# EAGLE design MKRRelayShield_V4.0 (EAGLE 9.1.3)
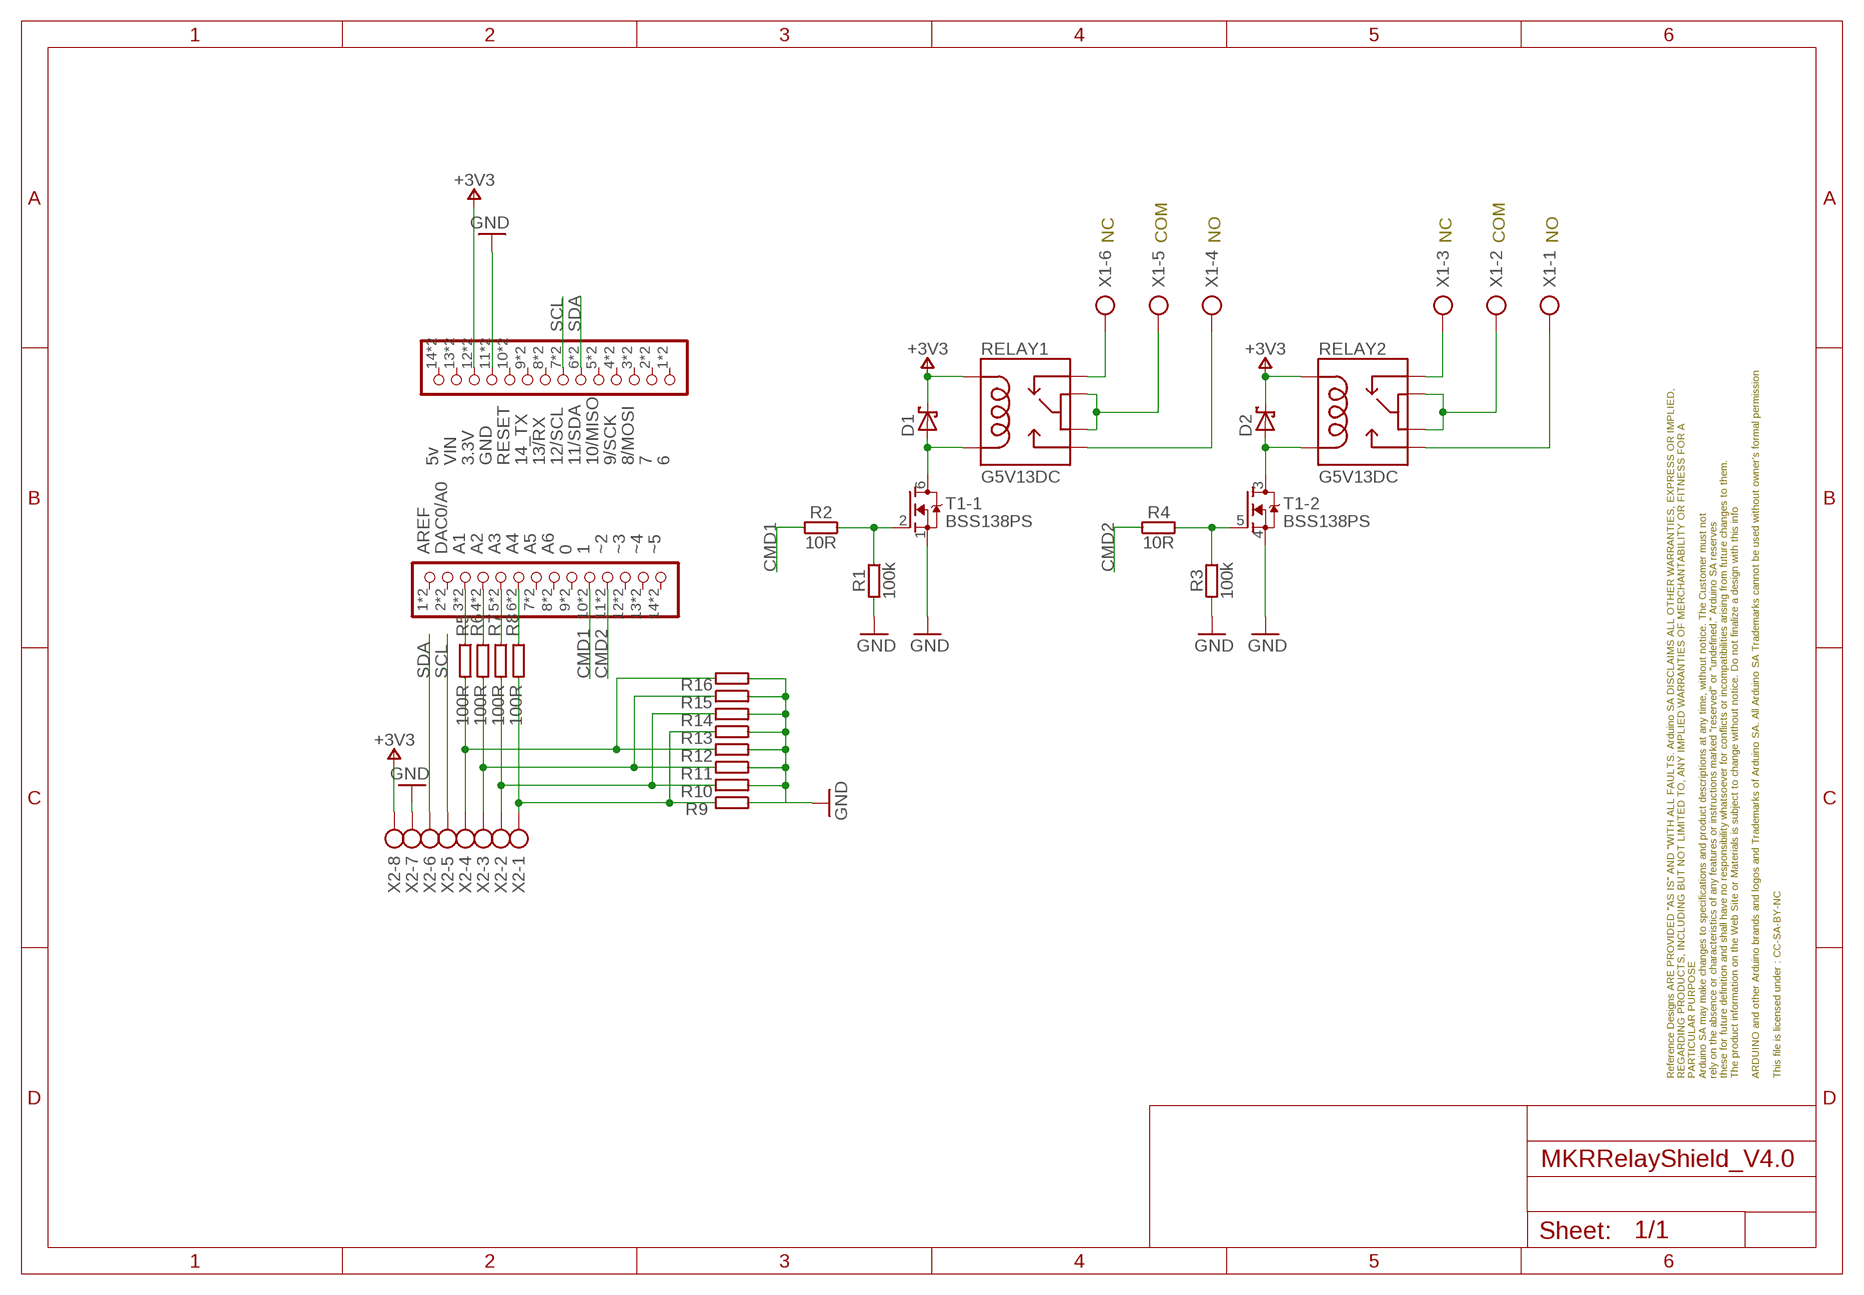
[diagram p0: schematic, sheet 1]

## Parts
D1  D_SCHOTTKYSO123  [SMA_DO123]
D2  D_SCHOTTKYSO123  [SMA_DO123]
FRAME1  DNP  A4L-LOC  [FRAME]
JP3  PINHD-1X14DOUBLE  [1X14-DOUBLE]
JP4  PINHD-1X14DOUBLE  [1X14-DOUBLE]
R1  100k  R-100K-0402  [0402-1005X55N]
R2  10R  R-10R-0402  [0402-1005X55N]
R3  100k  R-100K-0402  [0402-1005X55N]
R4  10R  R-10R-0402  [0402-1005X55N]
R5  100R  R-100R-0805  [0805-R2013X50N]
R6  100R  R-100R-0805  [0805-R2013X50N]
R7  100R  R-100R-0805  [0805-R2013X50N]
R8  100R  R-100R-0805  [0805-R2013X50N]
R9  10k  RTH-VERTICAL  [0204V]
R10  10k  RTH-VERTICAL  [0204V]
R11  10k  RTH-VERTICAL  [0204V]
R12  10k  RTH-VERTICAL  [0204V]
R13  100R  R-DNP-0805  [0805-R2013X50N]
R14  100R  R-DNP-0805  [0805-R2013X50N]
R15  100R  R-DNP-0805  [0805-R2013X50N]
R16  100R  R-DNP-0805  [0805-R2013X50N]
RELAY1  G5V13DC  RELAY-2G5Q  [RELAY-G5V]
RELAY2  G5V13DC  RELAY-2G5Q  [RELAY-G5V]
T1  BSS138PS  [SOT363]
X1  AK300/6  [AK300/6]
X2  AK300/8  [AK300/8]

## Nets
+3V3: D1.C D2.C JP4.12 JP4.26 RELAY1.2 RELAY2.2 X2.8
CMD1: JP3.10 JP3.24 R2.1
CMD2: JP3.11 JP3.25 R4.1
GND: JP4.11 JP4.25 R1.1 R3.1 R9.1 R10.1 R11.1 R12.1 R13.1 R14.1 R15.1 R16.1 T1.1(-1:S) T1.4(-2:S) X2.7
N$24: JP3.6 JP3.20 R8.2
N$25: R5.1 R12.2 R16.2 X2.4
N$26: JP3.5 JP3.19 R7.2
N$27: JP3.4 JP3.18 R6.2
N$28: JP3.3 JP3.17 R5.2
N$29: R6.1 R11.2 R15.2 X2.3
N$30: R7.1 R10.2 R14.2 X2.2
N$31: R8.1 R9.2 R13.2 X2.1
N$107: RELAY1.5 RELAY1.6 X1.5
N$108: D1.A RELAY1.9 T1.6(-1:D)
N$112: RELAY2.5 RELAY2.6 X1.2
N$463: D2.A RELAY2.9 T1.3(-2:D)
N$464: RELAY1.1 X1.6
N$467: RELAY1.10 X1.4
N$468: RELAY2.1 X1.3
N$471: RELAY2.10 X1.1
N$472: R1.2 R2.2 T1.2(-1:G)
N$473: R3.2 R4.2 T1.5(-2:G)
SCL: JP4.7 JP4.21 X2.5
SDA: JP4.6 JP4.20 X2.6
Unconnected: JP3.1 JP3.2 JP3.7 JP3.8 JP3.9 JP3.12 JP3.13 JP3.14 JP3.15 JP3.16 JP3.21 JP3.22 JP3.23 JP3.26 JP3.27 JP3.28 JP4.1 JP4.2 JP4.3 JP4.4 JP4.5 JP4.8 JP4.9 JP4.10 JP4.13 JP4.14 JP4.15 JP4.16 JP4.17 JP4.18 JP4.19 JP4.22 JP4.23 JP4.24 JP4.27 JP4.28

## Notes on the sheet
- NC | COM | NO | NC | COM | NO
- 5v | VIN | 3.3V | GND | RESET | 14_TX | 13/RX | 12/SCL | 11/SDA | 10/MISO | 9/SCK | 8/MOSI | 7 | 6
- AREF | DAC0/A0 | A1 | A2 | A3 | A4 | A5 | A6 | 0 | 1 | ~2 | ~3 | ~4 | ~5

## Library data of the parts
D1 D2 = Arduino-diodes:D_SCHOTTKY: Schottky Diodes; DATASHEET: http://www.mccsemi.com/up_pdf/MBR0520~MBR0580%28SOD123%29.pdf; DISTRIBUTOR-LINK: http://www.digikey.com/product-detail/en/micro-commercial-co/MBR0560-TP/MBR0560TPMSCT-ND/717368; DISTRIBUTOR-PN: MBR0560TPMSCT-ND; MANUFACTURER: Micro Comm; MANUFACTURER-PN: MBR0560-TP
FRAME1 = Arduino-utility:A4L-LOC: FRAME DIN A4, landscape with location and doc. field; CODE-ARDUINO: DNP; DATASHEET: DNP; DISTRIBUTOR-LINK: DNP; DISTRIBUTOR-PN: DNP; MANUFACTURER: DNP; MANUFACTURER-PN: DNP
JP3 JP4 = Arduino-connectors:PINHD-1X14: PIN HEADER; DATASHEET: -; DISTRIBUTOR-LINK: -; DISTRIBUTOR-PN: -; MANUFACTURER: ELDECO; MANUFACTURER-PN: FH254114DF08500T
R1 R3 = Arduino-rcl:R: SMD Resistor; DATASHEET: www.yageo.com.tw/exep/pages/download/literatures/PYu-R_INT-thick_7.pdf; DISTRIBUTOR-LINK: http://www.digikey.com/product-detail/en/yageo/RC0402FR-07100KL/311-100KLRCT-ND/729473; DISTRIBUTOR-PN: 311-100KLRCT-ND; MANUFACTURER: Yageo; MANUFACTURER-PN: RC0402FR-07100KL
R2 R4 = Arduino-rcl:R: SMD Resistor; DATASHEET: www.yageo.com.tw/exep/pages/download/literatures/PYu-R_INT-thick_7.pdf; DISTRIBUTOR-LINK: http://www.digikey.com/product-detail/en/yageo/RC0402JR-0710KL/311-10KJRCT-ND/729365; DISTRIBUTOR-PN: 311-10KJRCT-ND; MANUFACTURER: Yageo; MANUFACTURER-PN: RC0402JR-0710KL
R5-R8 = Arduino-rcl:R: SMD Resistor; DATASHEET: http://www.yageo.com.tw/exep/pages/download/literatures/PYu-R_INT-thick_7.pdf; DISTRIBUTOR-LINK: http://www.digikey.de/product-detail/en/yageo/RC0805FR-07100RL/311-100CRTR-ND/727543?cur=EUR&lang=en; DISTRIBUTOR-PN: 311-100CRTR-ND; MANUFACTURER: Yageo; MANUFACTURER-PN: RC0805FR-07100RL
R9-R16 = Arduino-rcl:R: SMD Resistor; DATASHEET: DNP; DISTRIBUTOR-LINK: DNP; DISTRIBUTOR-PN: DNP; MANUFACTURER: DNP; MANUFACTURER-PN: DNP
RELAY1 RELAY2 = Arduino-mechanical:RELAY-2: SPDT relay (COM-00100); DATASHEET: http://www.omron.com/ecb/products/pdf/en-g5v_1.pdf; DISTRIBUTOR-LINK: http://www.digikey.com/product-search/en?keywords=%20G5V-13%20DC3; DISTRIBUTOR-PN: Z3831-ND; MANUFACTURER: Omron; MANUFACTURER-PN: G5V-13 DC3
T1 = Arduino-transistors:BSS138PS: MOSFET 2N-CH 60V 0.32A 6TSSOP; DATASHEET: http://www.nxp.com/documents/data_sheet/BSS138PS.pdf; DISTRIBUTOR-LINK: http://www.digikey.com/product-detail/en/nxp-semiconductors/BSS138PS,115/568-8393-1-ND/2763927; DISTRIBUTOR-PN: 568-8393-1-ND; MANUFACTURER: NXP; MANUFACTURER-PN: BSS138PS,115
X1 = Arduino-connectors:AK300/6: CONNECTOR; DATASHEET: www.te.com/commerce/DocumentDelivery/DDEController?Action=srchrtrv&DocNm=282836&DocType=Customer+Drawing&DocLang=English; DISTRIBUTOR-LINK: http://www.digikey.com/product-detail/en/te-connectivity-amp-connectors/282836-6/A98339-ND/1131581; DISTRIBUTOR-PN: A98339-ND; MANUFACTURER: Phoenix; MANUFACTURER-PN: 282836-6
X2 = Arduino-connectors:AK300/8: CONNECTOR; DATASHEET: www.te.com/commerce/DocumentDelivery/DDEController?Action=srchrtrv&DocNm=282836&DocType=Customer+Drawing&DocLang=English; DISTRIBUTOR-LINK: http://www.digikey.com/product-detail/en/te-connectivity-amp-connectors/282836-8/A98080-ND/1826943; DISTRIBUTOR-PN: A98080-ND; MANUFACTURER: Phoenix; MANUFACTURER-PN: 282836-8

## Board
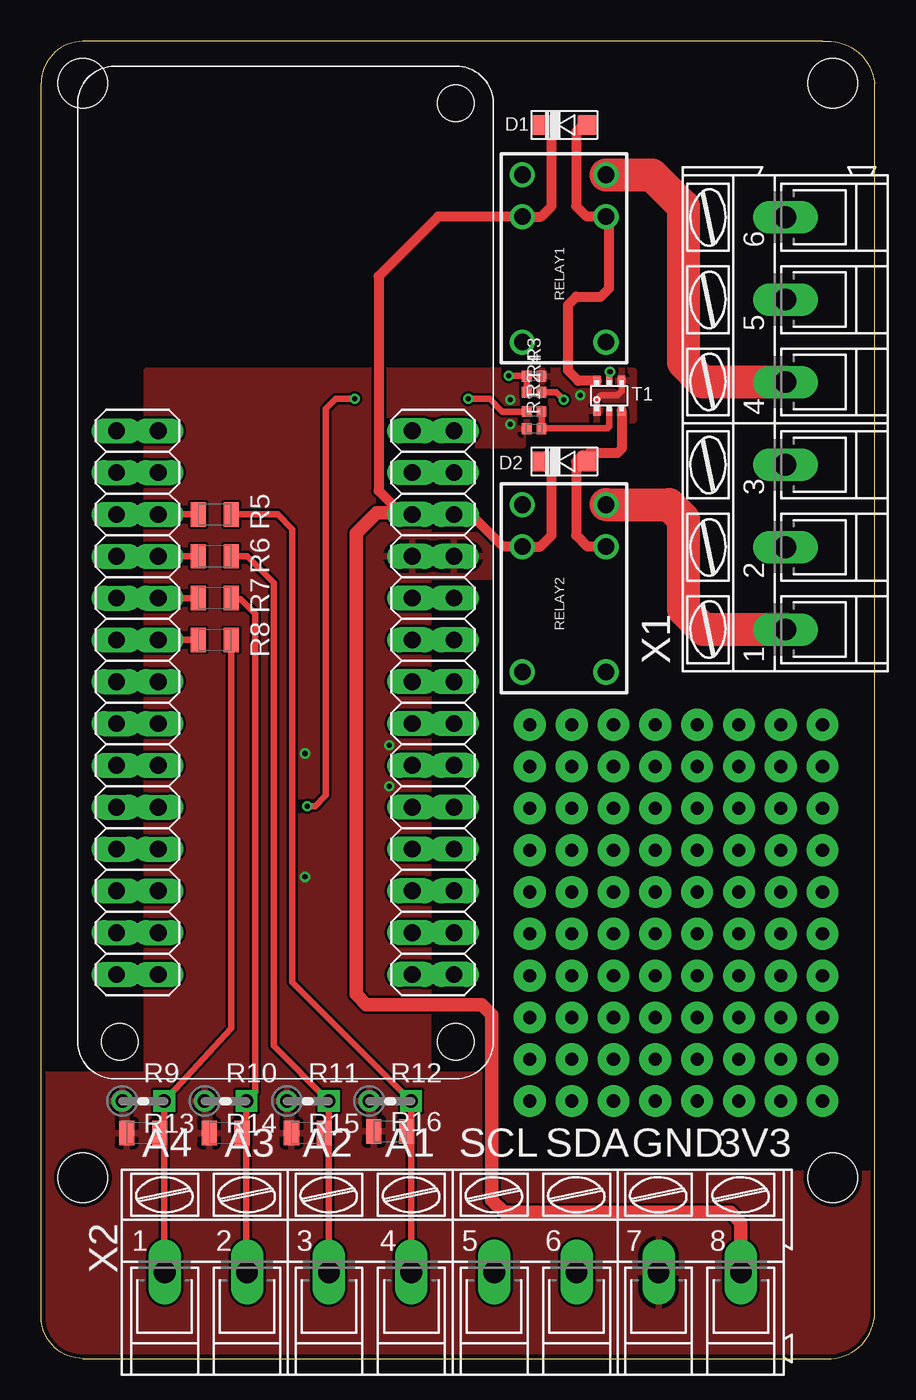
[diagram p1: board, top side]
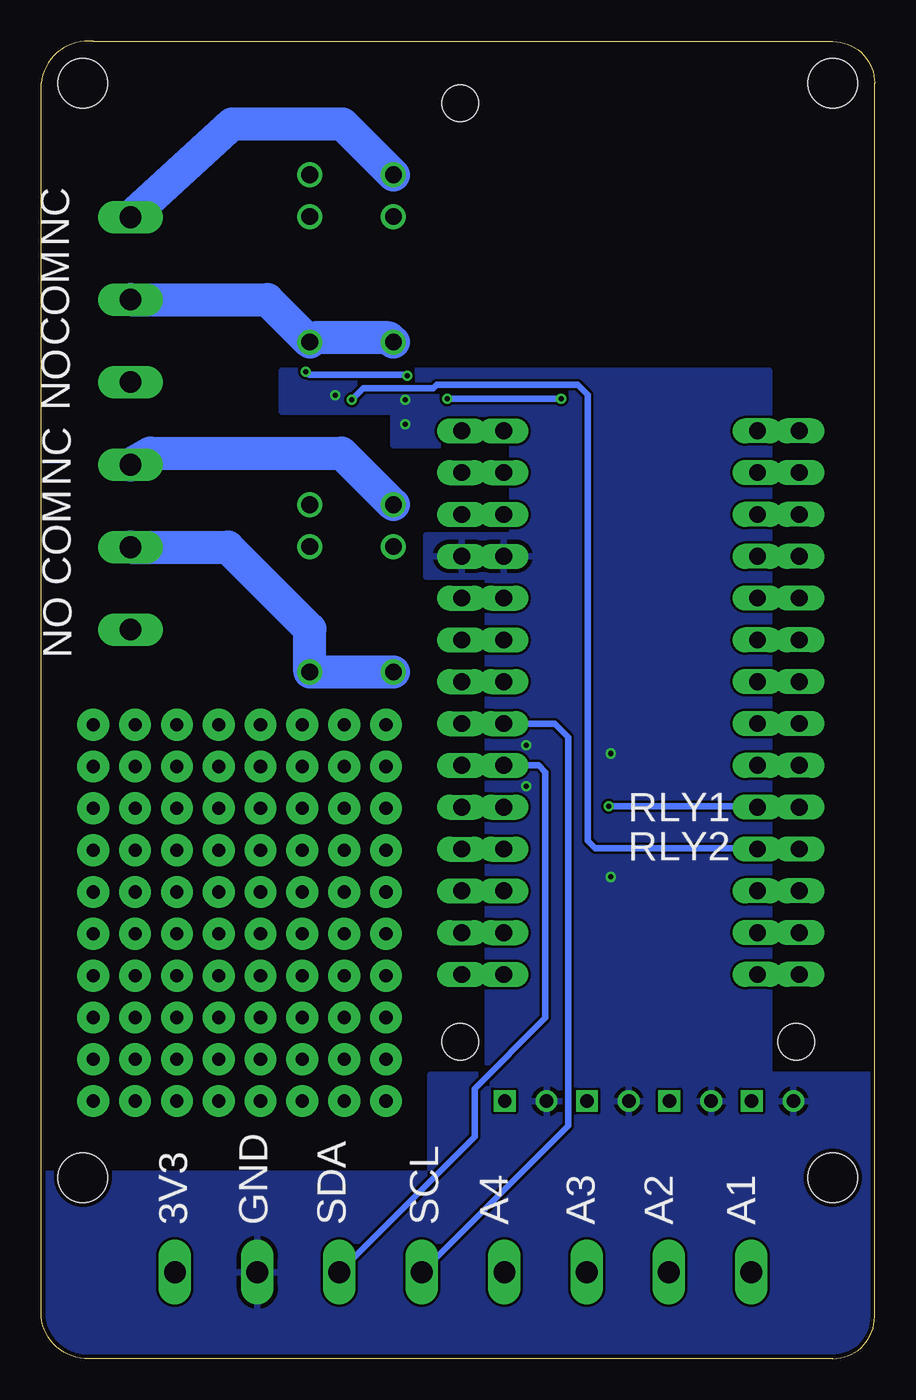
[diagram p2: board, bottom side, seen from below]

Size 50.62 x 80.03 mm. Coordinates in mm from the lower left corner, seen from the top.
Outline: 2.54,0.02 47.46,0.02 arc90 50.62,2.56 50.62,77.48 arc90 47.46,80.02 2.54,80.02 arc90 0,77.48 0,2.56 arc90 2.54,0.02
Copper layers (1*16): Top 0.035mm / dielectric 1.5mm / Bottom 0.035mm
Design rules "SeeedStudio_2layers": minimum track width 6mil, minimum drill 12mil, track to track 6mil, track to pad 6mil, pad to pad 6mil, via to via 6mil, smd to smd 0mil, copper to edge 10mil, drill to drill 10mil, minimum pad ring 10mil, minimum via ring 6mil, stop-mask expansion 2mil, vias tented up to drill 100mil, thermal gap 10mil
Holes 3 mm at 48.09,11 48.09,77.48 2.54,11 2.54,77.48
Holes 2.2 mm at 25.18,76.27 25.18,19.27 4.76,19.27

### Footprints (pad centres in the part's own frame; a part is rotated, then mirrored left to right if it is on the bottom)
SMA_DO123 = smd 1.2 x 1.2: A 0,-1.4; C 0,1.4
1X14-DOUBLE = drill 1.016 long: 1 -16.51,0; 2 -13.97,0; 3 -11.43,0; 4 -8.89,0; 5 -6.35,0; 6 -3.81,0; 7 -1.27,0; 8 1.27,0; 9 3.81,0; 10 6.35,0; 11 8.89,0; 12 11.43,0; 13 13.97,0; 14 16.51,0; 15 -16.51,2.54; 16 -13.97,2.54; 17 -11.43,2.54; 18 -8.89,2.54; 19 -6.35,2.54; 20 -3.81,2.54; 21 -1.27,2.54; 22 1.27,2.54; 23 3.81,2.54; 24 6.35,2.54; 25 8.89,2.54; 26 11.43,2.54; 27 13.97,2.54; 28 16.51,2.54
0402-1005X55N = smd 0.62 x 0.62: 1 -0.45,0; 2 0.45,0
0805-R2013X50N = smd 0.95 x 1.45: 1 -1,0; 2 1,0
0204V = drill 0.813: 1 -1.27,0 | drill 0.813 square: 2 1.27,0
RELAY-G5V = drill 1.016: 1 5.08,2.54; 2 2.54,2.54; 5 -5.08,2.54; 6 -5.08,-2.54; 9 2.54,-2.54; 10 5.08,-2.54
SOT363 = smd 0.6 x 0.5: 1 -0.9,0.75; 3 -0.9,-0.75; 4 0.9,-0.75; 6 0.9,0.75 | smd 0.6 x 0.4: 2 -0.9,0; 5 0.9,0
AK300/6 = drill 1.321 long: 1 -12.522,0; 2 -7.518,0; 3 -2.515,0; 4 2.515,0; 5 7.518,0; 6 12.522,0
AK300/8 = drill 1.321 long: 1 -17.501,0; 2 -12.497,0; 3 -7.518,0; 4 -2.515,0; 5 2.515,0; 6 7.518,0; 7 12.497,0; 8 17.501,0

### Placement (x,y rotation side)
D1  31.77,74.95 90 top
D2  31.77,54.51 90 top
FRAME1  0.3,-4.58 0 top  (outside the outline)
JP3  4.58,39.86 270 top
JP4  25.07,39.86 90 top
R1  29.94,56.49 0 top
R2  29.94,57.54 0 top
R3  29.94,59.69 180 top
R4  29.94,58.72 180 top
R5  10.55,51.29 180 top
R6  10.55,48.75 180 top
R7  10.55,46.21 180 top
R8  10.55,43.67 180 top
R9  6.2,15.66 0 top
R10  11.2,15.66 0 top
R11  16.2,15.66 0 top
R12  21.2,15.66 0 top
R13  6.2,13.72 0 top
R14  11.2,13.72 0 top
R15  16.2,13.72 0 top
R16  21.2,13.82 0 top
RELAY1  31.77,66.84 90 top
RELAY2  31.77,46.8 90 top
T1  34.5,58.5 90 top
X1  45.2,56.82 90 top
X2  25,5.27 0 top

### Tracks (layer width: path | path; a pad name or v marks a point on that pad's centre or on a via)
+3V3
  Top 0.61: D1.C 31,74.32 31,70.02 30.36,69.38 RELAY1.2 24.11,69.38 20.5,65.77 20.5,52.72 22,51.22 22.54,51.22 JP4.26 22.52,51.27 | D2.C 31,54.28 31,50.02 30.32,49.34 RELAY2.2 28.05,49.34 26.11,51.29 JP4.12 22.11,51.29 22,51.39
  Top 0.813: X2.8 42.5,8.27 41.88,8.89 28.12,8.89 27.38,9.64 27.38,20.89 26.75,21.52 19.75,21.52 19.12,22.14 19.12,50.14 20.38,51.39 22,51.39 22.43,51.39 JP4.26
CMD1  (via drill 0.3 pad 0.6)
  Top 0.406: R2.1 28.02,57.54 27.24,58.32 v25.95,58.32 | v19.05,58.32 17.9,58.32 17.3,57.72 17.3,34.22 16.65,33.57 v16.15,33.57
  Bottom 0.406: v19.05,58.32 v25.95,58.32 | v16.15,33.57 7.17,33.57 JP3.24 JP3.10
CMD2  (via drill 0.3)
  Top 0.406: R4.1 31.3,58.72 v31.75,58.27
  Bottom 0.406: v31.75,58.27 31.05,58.97 26.8,58.97 26.6,59.17 18.02,59.17 17.43,58.57 17.43,31.47 16.98,31.02 7.17,31.02 JP3.25 JP3.11
GND  (via drill 0.3, 0.3 pad 0.6)
  Top 0.406: T1.4 35.25,58.77 35,58.52 34,58.52 33.75,58.27 T1.1
  other vias: 28.5,56.77 28.5,58.27 32.75,58.52 16.02,29.27 16.02,36.77 21.15,37.27 21.15,34.77
  pour Bottom: 6.4,60.02 36,60.02 36,57.52 29.25,57.52 29.25,55.48 22,55.48 22,50.02 27.25,50.02 27.25,47.52 23.5,47.52 23.5,17.26 23.88,17.27 27,17.27 27,11.26 50.62,11.26 50.62,-1.05 0,-1.17 0,17.27 6.4,17.27
  pour Top: 6.4,60.02 36,60.02 36,57.02 29.25,57.02 29.25,55.48 23.5,55.48 23.5,50.02 27.25,50.02 27.25,47.52 23.5,47.52 23.5,17.27 27,17.27 27,11.26 50.62,11.26 50.62,-1.05 0,-1.17 0,17.27 6.4,17.27
N$3  (via drill 0.8 pad 1.93)
  other vias: 47.46,30.9
N$4  (via drill 0.8 pad 1.93)
  other vias: 42.38,38.52
N$5  (via drill 0.8 pad 1.93)
  other vias: 37.3,28.36
N$6  (via drill 0.8 pad 1.93)
  other vias: 47.46,25.82
N$7  (via drill 0.8 pad 1.93)
  other vias: 47.46,23.28
N$8  (via drill 0.8 pad 1.93)
  other vias: 47.46,20.74
N$9  (via drill 0.8 pad 1.93)
  other vias: 47.46,18.2
N$10  (via drill 0.8 pad 1.93)
  other vias: 47.46,15.66
N$24
  Top 0.406: JP3.6 JP3.20 R8.2
N$25
  Top 0.406: R12.2 22.48,16.02 | R5.1 14.36,51.29 15.25,50.39 15.25,22.88 R12.2 | X2.4 22.48,13.92 | 22.48,13.92 22.48,15.64 R12.2 | R16.2 22.39,13.82 22.48,13.92
N$26
  Top 0.406: JP3.5 JP3.19 R7.2
N$27
  Top 0.406: JP3.4 JP3.18 R6.2
N$28
  Top 0.406: 7.13,51.27 JP3.17 | JP3.3 JP3.17 | R5.2 JP3.17
N$29
  Top 0.406: R11.2 17.48,16.02 | R6.1 12.52,48.75 14.12,47.14 14.12,19 R11.2 | X2.3 17.47,13.82 | 17.47,13.82 R11.2 | R15.2 17.37,13.72 17.47,13.82
N$30
  Top 0.406: R10.2 12.5,16.02 | R7.1 11.62,46.14 12.12,46.14 13,45.27 13,16.19 R10.2 | X2.2 12.47,5.27 12.47,13.82 | 12.47,13.82 R10.2 | R14.2 12.37,13.72 12.47,13.82
N$31
  Top 0.406: R9.2 7.5,16.02 | R8.1 11.55,20.07 R9.2 | X2.1 7.47,5.27 7.47,13.42 | 7.47,13.42 R9.2 | R13.2 7.2,13.69 7.47,13.42
N$107
  Bottom 2: X1.5 36.89,64.33 RELAY1.6 34.05,62.02 29.5,62.02 RELAY1.5
N$108
  Top 0.61: D1.A 33,74.78 32.76,74.78 32.5,74.52 32.5,70.02 33.14,69.38 RELAY1.9 34.5,69.19 34.5,65.02 34,64.52 32.5,64.52 32,64.02 32,60.02 32.62,59.4 T1.6
N$112
  Bottom 2: X1.2 39.28,49.3 34.31,44.33 RELAY2.6 RELAY2.5
N$114  (via drill 0.8 pad 1.93)
  other vias: 29.68,15.66
N$115  (via drill 0.8 pad 1.93)
  other vias: 32.22,15.66
N$116  (via drill 0.8 pad 1.93)
  other vias: 34.76,15.66
N$117  (via drill 0.8 pad 1.93)
  other vias: 37.3,15.66
N$122  (via drill 0.8 pad 1.93)
  other vias: 39.84,15.66
N$124  (via drill 0.8 pad 1.93)
  other vias: 42.38,15.66
N$131  (via drill 0.8 pad 1.93)
  other vias: 44.92,15.66
N$136  (via drill 0.8 pad 1.93)
  other vias: 29.68,18.2
N$140  (via drill 0.8 pad 1.93)
  other vias: 32.22,18.2
N$142  (via drill 0.8 pad 1.93)
  other vias: 34.76,18.2
N$155  (via drill 0.8 pad 1.93)
  other vias: 37.3,18.2
N$157  (via drill 0.8 pad 1.93)
  other vias: 39.84,18.2
N$172  (via drill 0.8 pad 1.93)
  other vias: 42.38,18.2
N$175  (via drill 0.8 pad 1.93)
  other vias: 44.92,18.2
N$179  (via drill 0.8 pad 1.93)
  other vias: 29.68,20.74
N$180  (via drill 0.8 pad 1.93)
  other vias: 32.22,20.74
N$185  (via drill 0.8 pad 1.93)
  other vias: 34.76,20.74
N$186  (via drill 0.8 pad 1.93)
  other vias: 37.3,20.74
N$191  (via drill 0.8 pad 1.93)
  other vias: 39.84,20.74
N$192  (via drill 0.8 pad 1.93)
  other vias: 42.38,20.74
N$196  (via drill 0.8 pad 1.93)
  other vias: 44.92,20.74
N$197  (via drill 0.8 pad 1.93)
  other vias: 29.68,23.28
N$198  (via drill 0.8 pad 1.93)
  other vias: 32.22,23.28
N$199  (via drill 0.8 pad 1.93)
  other vias: 34.76,23.28
N$200  (via drill 0.8 pad 1.93)
  other vias: 37.3,23.28
N$201  (via drill 0.8 pad 1.93)
  other vias: 39.84,23.28
N$202  (via drill 0.8 pad 1.93)
  other vias: 42.38,23.28
N$203  (via drill 0.8 pad 1.93)
  other vias: 44.92,23.28
N$204  (via drill 0.8 pad 1.93)
  other vias: 29.68,25.82
N$205  (via drill 0.8 pad 1.93)
  other vias: 32.22,25.82
N$206  (via drill 0.8 pad 1.93)
  other vias: 34.76,25.82
N$207  (via drill 0.8 pad 1.93)
  other vias: 37.3,25.82
N$208  (via drill 0.8 pad 1.93)
  other vias: 39.84,25.82
N$209  (via drill 0.8 pad 1.93)
  other vias: 42.38,25.82
N$210  (via drill 0.8 pad 1.93)
  other vias: 44.92,25.82
N$211  (via drill 0.8 pad 1.93)
  other vias: 47.46,28.36
N$212  (via drill 0.8 pad 1.93)
  other vias: 44.92,28.36
N$213  (via drill 0.8 pad 1.93)
  other vias: 42.38,28.36
N$214  (via drill 0.8 pad 1.93)
  other vias: 39.84,28.36
N$215  (via drill 0.8 pad 1.93)
  other vias: 32.22,28.36
N$216  (via drill 0.8 pad 1.93)
  other vias: 34.76,28.36
N$217  (via drill 0.8 pad 1.93)
  other vias: 29.68,28.36
N$218  (via drill 0.8 pad 1.93)
  other vias: 29.68,30.9
N$219  (via drill 0.8 pad 1.93)
  other vias: 32.22,30.9
N$220  (via drill 0.8 pad 1.93)
  other vias: 34.76,30.9
N$221  (via drill 0.8 pad 1.93)
  other vias: 37.3,30.9
N$222  (via drill 0.8 pad 1.93)
  other vias: 39.84,30.9
N$223  (via drill 0.8 pad 1.93)
  other vias: 42.38,30.9
N$224  (via drill 0.8 pad 1.93)
  other vias: 44.92,30.9
N$225  (via drill 0.8 pad 1.93)
  other vias: 29.68,35.98
N$226  (via drill 0.8 pad 1.93)
  other vias: 29.68,38.52
N$227  (via drill 0.8 pad 1.93)
  other vias: 29.68,33.44
N$228  (via drill 0.8 pad 1.93)
  other vias: 32.22,33.44
N$229  (via drill 0.8 pad 1.93)
  other vias: 32.22,35.98
N$230  (via drill 0.8 pad 1.93)
  other vias: 32.22,38.52
N$231  (via drill 0.8 pad 1.93)
  other vias: 34.76,35.98
N$232  (via drill 0.8 pad 1.93)
  other vias: 34.76,33.44
N$233  (via drill 0.8 pad 1.93)
  other vias: 37.3,33.44
N$234  (via drill 0.8 pad 1.93)
  other vias: 37.3,35.98
N$235  (via drill 0.8 pad 1.93)
  other vias: 34.76,38.52
N$236  (via drill 0.8 pad 1.93)
  other vias: 39.84,35.98
N$237  (via drill 0.8 pad 1.93)
  other vias: 37.3,38.52
N$238  (via drill 0.8 pad 1.93)
  other vias: 39.84,33.44
N$239  (via drill 0.8 pad 1.93)
  other vias: 44.92,33.44
N$240  (via drill 0.8 pad 1.93)
  other vias: 42.38,33.44
N$241  (via drill 0.8 pad 1.93)
  other vias: 47.46,33.44
N$242  (via drill 0.8 pad 1.93)
  other vias: 47.46,35.98
N$243  (via drill 0.8 pad 1.93)
  other vias: 44.92,35.98
N$244  (via drill 0.8 pad 1.93)
  other vias: 47.46,38.52
N$245  (via drill 0.8 pad 1.93)
  other vias: 44.92,38.52
N$246  (via drill 0.8 pad 1.93)
  other vias: 42.38,35.98
N$247  (via drill 0.8 pad 1.93)
  other vias: 39.84,38.52
N$463
  Top 0.61: RELAY2.9 33.18,49.34 32.5,50.02 32.5,54.52 32.89,54.91 D2.A 33.28,55.02 35,55.02 35.25,55.27 T1.3
N$464
  Bottom 2: RELAY1.1 32.33,75.02 39.02,75.02 X1.6
N$467
  Top 2: X1.4 40.19,59.33 39,60.52 39,70.02 37.1,71.92 RELAY1.10
N$468
  Bottom 2: RELAY2.1 32.37,55.02 43.98,55.02 X1.3
N$471
  Top 2: RELAY2.10 38.14,51.88 39,51.02 39,45.52 40.22,44.29 X1.1
N$472
  Top 0.406: T1.2 34.5,56.62 34.4,56.52 30.47,56.52 R1.2 R2.2
N$473  (via drill 0.3)
  Top 0.406: T1.5 34.5,60.02 v34.55,59.97 | v28.4,59.72 29.42,59.72 R3.2 R4.2
  Bottom 0.406: v28.4,59.72 28.45,59.77 34.35,59.77 v34.55,59.97
SCL
  Bottom 0.406: X2.5 18.62,14.16 18.62,37.77 19.45,38.59 JP4.21 JP4.7
SDA
  Bottom 0.406: JP4.20 JP4.6 20.41,36.05 20,35.64 20,20.72 24.3,16.42 24.3,13.48 X2.6

### Text on the board
tPlace: A4 | A3 | A2 | A1 | SCL | SDA | GND | 3V3
bPlace: NC | COM | NO | NC | COM | NO | RLY1 | RLY2 | A1 | A2 | A3 | A4 | SCL | SDA | GND | 3V3